# EAGLE design blinker (EAGLE 9.6.2)
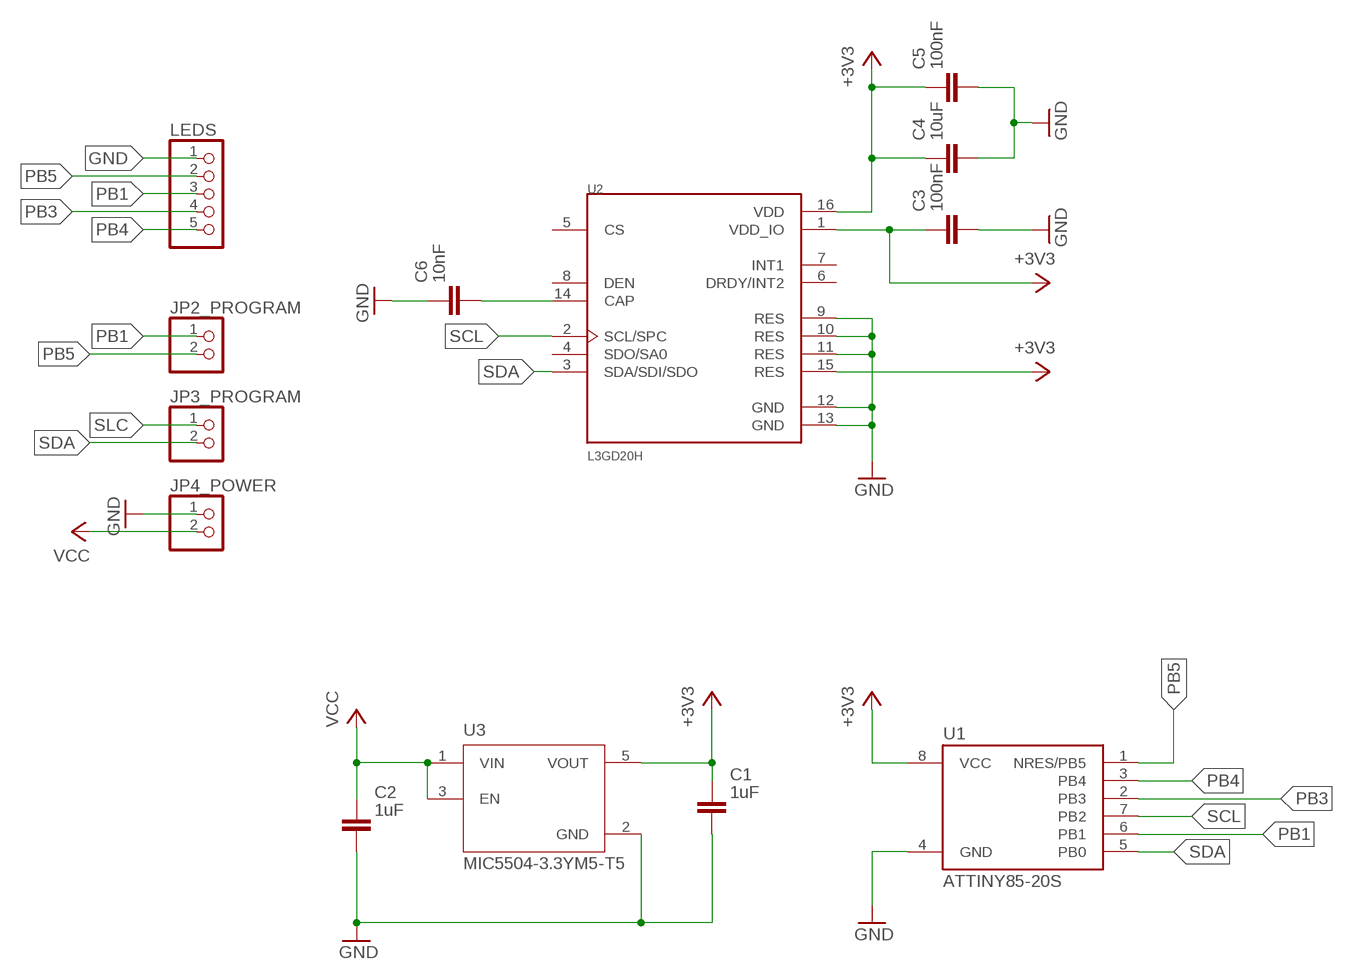
[diagram p0: schematic, sheet 1]

## Parts
C1  1uF  C_CHIP-1206(3216-METRIC)  [CAPC3216X135]
C2  1uF  C_CHIP-1206(3216-METRIC)  [CAPC3216X135]
C3  100nF  C_CHIP-1206(3216-METRIC)  [CAPC3216X135]
C4  10uF  C_CHIP-1206(3216-METRIC)  [CAPC3216X135]
C5  100nF  C_CHIP-1206(3216-METRIC)  [CAPC3216X135]
C6  10nF  C_CHIP-1206(3216-METRIC)  [CAPC3216X135]
JP2_PROGRAM  PINHD-1X2/90  [1X02/90]
JP3_PROGRAM  PINHD-1X2/90  [1X02/90]
JP4_POWER  PINHD-1X2/90  [1X02/90]
LEDS  PINHD-1X5/90  [1X05/90]
U1  ATTINY85-20S  [SOIC8_EIAJ_208MIL]
U2  L3GD20H  [LGA16R50P7X5_300X300X100]
U3  MIC5504-3.3YM5-T5  [SOT95P280X145-5N]

## Nets
+3V3: C1.1 C3.1 C4.1 C5.1 U1.8(VCC) U2.1(VDD_IO) U2.15(RES) U2.16(VDD) U3.5(VOUT)
GND: C1.2 C2.2 C3.2 C4.2 C5.2 C6.1 JP4_POWER.1 LEDS.1 U1.4(GND) U2.9(RES) U2.10(RES) U2.11(RES) U2.12(GND) U2.13(GND) U3.2(GND)
N$1: C6.2 U2.14(CAP)
PB1: JP2_PROGRAM.1 LEDS.3 U1.6(PB1)
PB3: LEDS.4 U1.2(PB3)
PB4: LEDS.5 U1.3(PB4)
PB5: JP2_PROGRAM.2 LEDS.2 U1.1(NRES/PB5)
SCL: U1.7(PB2) U2.2(SCL/SPC)
SDA: JP3_PROGRAM.2 U1.5(PB0) U2.3(SDA/SDI/SDO)
SLC: JP3_PROGRAM.1
VCC: C2.1 JP4_POWER.2 U3.1(VIN) U3.3(EN)
Unconnected: U2.4(SDO/SA0) U2.5(CS) U2.6(DRDY/INT2) U2.7(INT1) U2.8(DEN)

## Library data of the parts
C1-C6 = Capacitor:C: Capacitor - Generic; CATEGORY: Capacitor
JP2_PROGRAM JP3_PROGRAM JP4_POWER = pinhead:PINHD-1X2: PIN HEADER
LEDS = pinhead:PINHD-1X5: PIN HEADER
U1 = _hhn_attiny25_45_85:ATTINY85*: ATMEL ATtiny 85 Packages: P = PDIP 08 30mil S = SOIC 08 EIAJ 208mil Technologies Note: for complete ordering code (temp. range, finish, tape&reel etc.) see www.atmel.com • Supply Voltage: V = (1.8…5.5)V | [blank] = (2.7…5.5)V • Speed: 10 = 10 MHz | 20 = 20 MHz Author: Dipl.-Ing. FH Rainer Bayer HHN Hochschule Heilbronn (Heilbronn University), rainer.bayer@hs-heilbronn.de Ingenieurbüro ing-rb, mail@ing-rb.de
U2 = L3GD20H:L3GD20H: MEMS motion sensor: three-axis digital output gyroscope Buy Part <https://snapeda.com/parts/L3GD20H/STMicroelectronics/view-part/?ref=eda>; AVAILABILITY: Bad; DESCRIPTION: Gyroscope X (Pitch), Y (Roll), Z (Yaw) ±245, 500, 2000 6.25Hz ~ 400Hz I²C, SPI 16-LGA (3x3); MF: STMicroelectronics; MP: L3GD20H; PACKAGE: LGA-16 STMicroelectronics; PRICE: None
U3 = MIC5504-3.3YM5-T5:MIC5504-3.3YM5-T5: Linear Voltage Regulator IC 1 Output 300mA SOT-23-5 Buy Part <https://snapeda.com/parts/MIC5504-3.3YM5-T5/Microchip/view-part/?ref=eda>; ARROW_ELECTRONICS-PURCHASE-URL: https://snapeda.com/shop?store=Arrow+Electronics&id=1219468; AVAILABILITY: Good; DESCRIPTION: Linear Voltage Regulator IC 1 Output 300mA SOT-23-5; DIGIKEY-PURCHASE-URL: https://snapeda.com/shop?store=DigiKey&id=1219468; MF: Microchip; MOUSER-PURCHASE-URL: https://snapeda.com/shop?store=Mouser&id=1219468; MP: MIC5504-3.3YM5-T5; PACKAGE: SOT-23-5 Microchip; PRICE: None

## Board
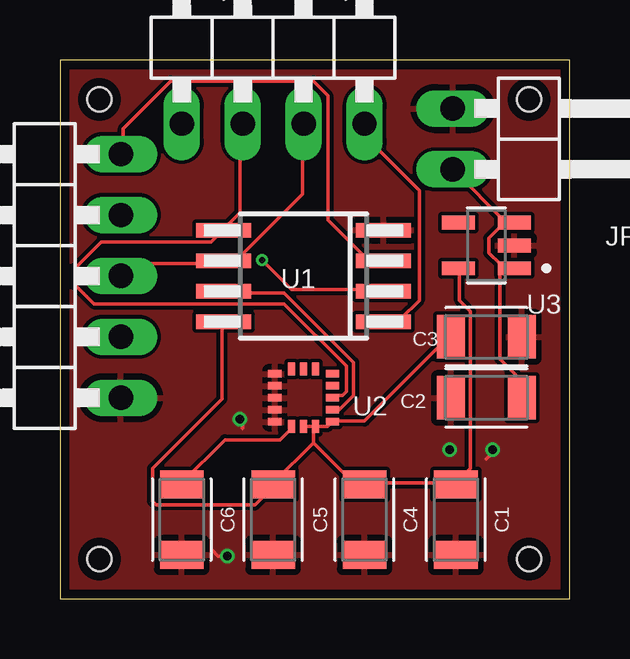
[diagram p1: board, top side]
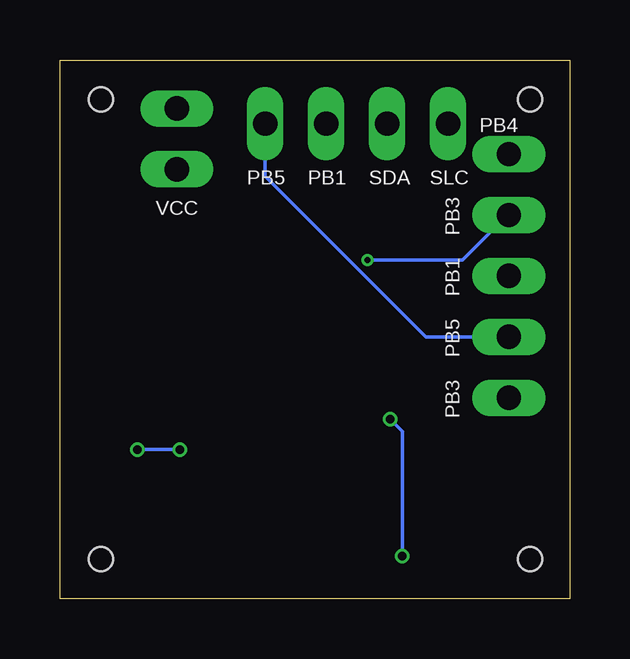
[diagram p2: board, bottom side, seen from below]

Size 21.26 x 22.47 mm. Coordinates in mm from the lower left corner, seen from the top.
Outline: 0,0 21.26,0 21.26,22.47 0,22.47 0,0
Copper layers (1*16): Top 0.035559375mm / dielectric 1.6mm / Bottom 0.035559375mm
Design rules "oshpark-2layer": minimum track width 6mil, minimum drill 10mil, track to track 6mil, track to pad 6mil, pad to pad 6mil, via to via 6mil, smd to smd 6mil, copper to edge 15mil, drill to drill 6mil, minimum pad ring 5mil, minimum via ring 5mil, stop-mask expansion 2.5mil, vias tented up to drill 0mil, thermal gap 10mil
Holes 1 mm at 1.65,1.65 19.56,1.65 19.56,20.83 1.65,20.83

### Footprints (pad centres in the part's own frame; a part is rotated, then mirrored left to right if it is on the bottom)
CAPC3216X135 = smd 1.165 x 1.815: 1 -1.475,0; 2 1.475,0
1X02/90 = drill 1.016 long: 1 -1.27,-3.81; 2 1.27,-3.81
1X05/90 = drill 1.016 long: 1 -5.08,-3.81; 2 -2.54,-3.81; 3 0,-3.81; 4 2.54,-3.81; 5 5.08,-3.81
SOIC8_EIAJ_208MIL = smd 0.6 x 2.286: 1 -1.905,-3.33; 2 -0.635,-3.33; 3 0.635,-3.33; 4 1.905,-3.33; 5 1.905,3.33; 6 0.635,3.33; 7 -0.635,3.33; 8 -1.905,3.33
LGA16R50P7X5_300X300X100 = smd 0.55 x 0.3: 1 -1.2,1; 2 -1.2,0.5; 3 -1.2,0; 4 -1.2,-0.5; 5 -1.2,-1; 9 1.2,-1; 10 1.2,-0.5; 11 1.2,0; 12 1.2,0.5; 13 1.2,1 | smd 0.3 x 0.55: 6 -0.5,-1.2; 7 0,-1.2; 8 0.5,-1.2; 14 0.5,1.2; 15 0,1.2; 16 -0.5,1.2
SOT95P280X145-5N = smd 1.39 x 0.58: 1 -1.165,0.95; 2 -1.165,0; 3 -1.165,-0.95; 4 1.165,-0.95; 5 1.165,0.95

### Placement (x,y rotation side)
C1  16.51,3.3 270 top
C2  17.78,8.38 180 top
C3  17.78,10.92 0 top
C4  12.7,3.3 270 top
C5  8.89,3.3 270 top
C6  5.08,3.3 90 top
JP2_PROGRAM  11.43,23.62 0 top
JP3_PROGRAM  6.35,23.62 0 top
JP4_POWER  20.19,19.18 270 top
LEDS  -1.27,13.46 90 top
U1  10.16,13.46 90 top
U2  10.16,8.38 180 top
U3  17.78,14.73 180 top

### Tracks (layer width: path | path; a pad name or v marks a point on that pad's centre or on a via)
+3V3
  Top 0.152: 16.51,4.83 17.12,5.44 17.12,11.99 16.66,12.45 16.66,13.67 U3.5 | 10.57,6.5 10.57,7.11 U2.16 | 10.57,6.5 8.89,4.83 C5.1 8.89,4.67 8.13,3.91 4.01,3.91 3.86,4.06 3.86,5.44 6.76,8.33 6.76,11.53 U1.8 | 12.7,4.83 12.24,4.83 10.57,6.5 | 12.7,4.83 16.51,4.83 | 16.51,4.83 C1.1 | 12.7,4.83 C4.1 | C3.1 16.2,10.92 12.7,7.42 11.48,7.42 U2.1 11.16,7.18 U2.16 | U2.15 U2.16
GND  (via drill 0.35)
  Top 0.152: v6.98,1.78 6.6,1.78 6.35,2.03 | 16.3,6.27 v16.26,6.22 | v18.03,6.22 18.03,6.1 17.78,5.84 | v7.49,7.49 7.62,7.37 7.62,7.11
  Bottom 0.152: v6.98,1.78 6.98,6.98 v7.49,7.49 | v16.26,6.22 v18.03,6.22
  pour Top: -19.05,33.78 -19.05,-14.48 45.72,-14.48 45.72,33.78
N$1
  Top 0.152: U2.14 9.65,7.11 9.17,6.63 6.88,6.63 5.08,4.83 C6.2
PB1
  Top 0.152: LEDS.3 2.64,13.51 3.1,13.97 6.76,13.97 U1.6 6.91,14.12 7.37,14.12 10.11,16.87 10.11,19.76 JP2_PROGRAM.1
PB3  (via drill 0.25)
  Top 0.152: v8.43,14.12 9.65,12.9 13.46,12.9 U1.2
  Bottom 0.152: v8.43,14.12 4.47,14.12 2.64,15.95 LEDS.4
PB4
  Top 0.152: U1.3 13.46,14.12 12.85,14.12 11.18,15.8 11.18,20.98 10.57,21.59 4.62,21.59 2.64,19.61 2.64,18.54 LEDS.5
PB5
  Top 0.152: JP2_PROGRAM.2 12.7,19.3 14.99,17.02 14.99,12.45 14.22,11.68 13.61,11.68 U1.1
  Bottom 0.152: LEDS.2 5.99,10.92 12.7,17.63 JP2_PROGRAM.2
SCL
  Top 0.152: U2.2 11.48,7.87 11.63,7.87 12.24,8.48 12.24,9.85 9.35,12.75 6.91,12.75 U1.7
SDA
  Top 0.152: U2.3 11.48,8.48 11.79,8.48 11.94,8.64 11.94,9.7 9.35,12.29 1.42,12.29 0.66,13.06 0.66,13.82 1.73,14.88 6.3,14.88 6.76,15.34 U1.5 6.91,15.49 7.52,16.1 7.52,19.76 JP3_PROGRAM.2
VCC
  Top 0.152: 18.34,13.97 17.88,14.43 17.88,15.04 18.49,15.65 18.64,15.65 | 18.34,13.97 18.49,13.82 18.8,13.82 U3.1 18.34,13.97 | 18.64,15.65 18.8,15.65 U3.3 18.64,15.65 | 18.34,13.97 18.34,10.01 19.25,9.09 19.25,8.48 C2.1 | 18.64,15.65 JP4_POWER.2

### Text on the board
bNames: PB4 | PB3 | SLC | SDA | PB1 | PB5 | VCC | PB1 | PB5 | PB3